# EasyEDA Pro project 第二版-FD6288Q-V1.0.epro, board PCB1
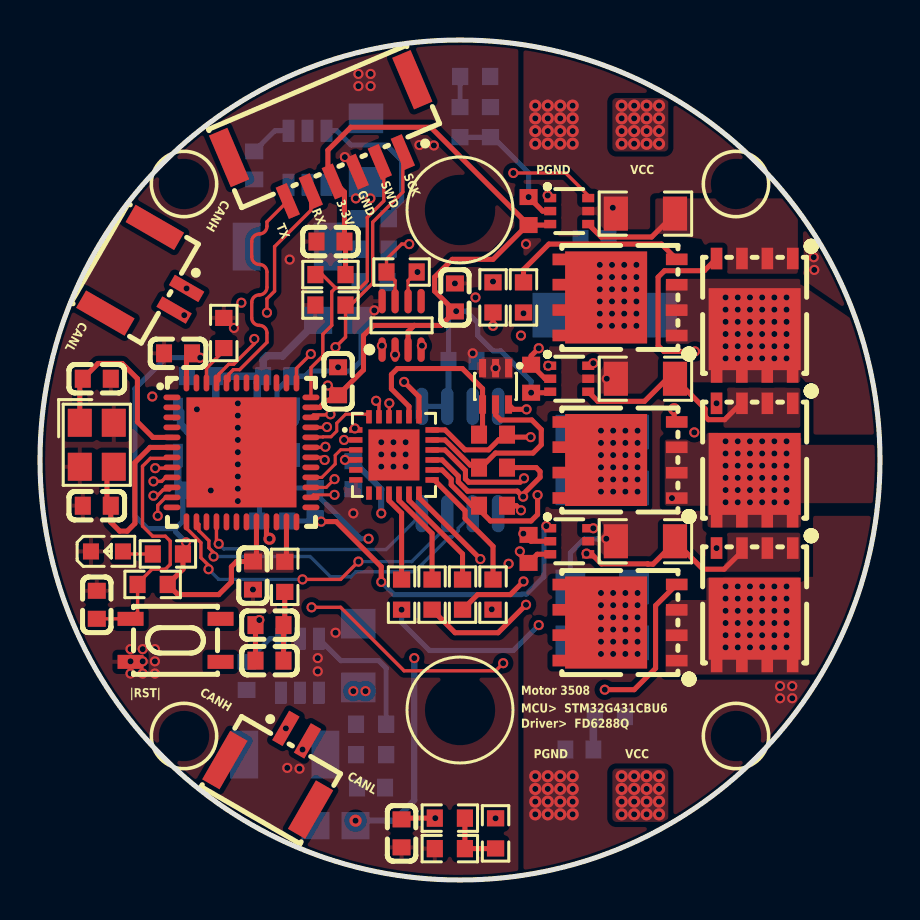
[diagram p1: board, top side]
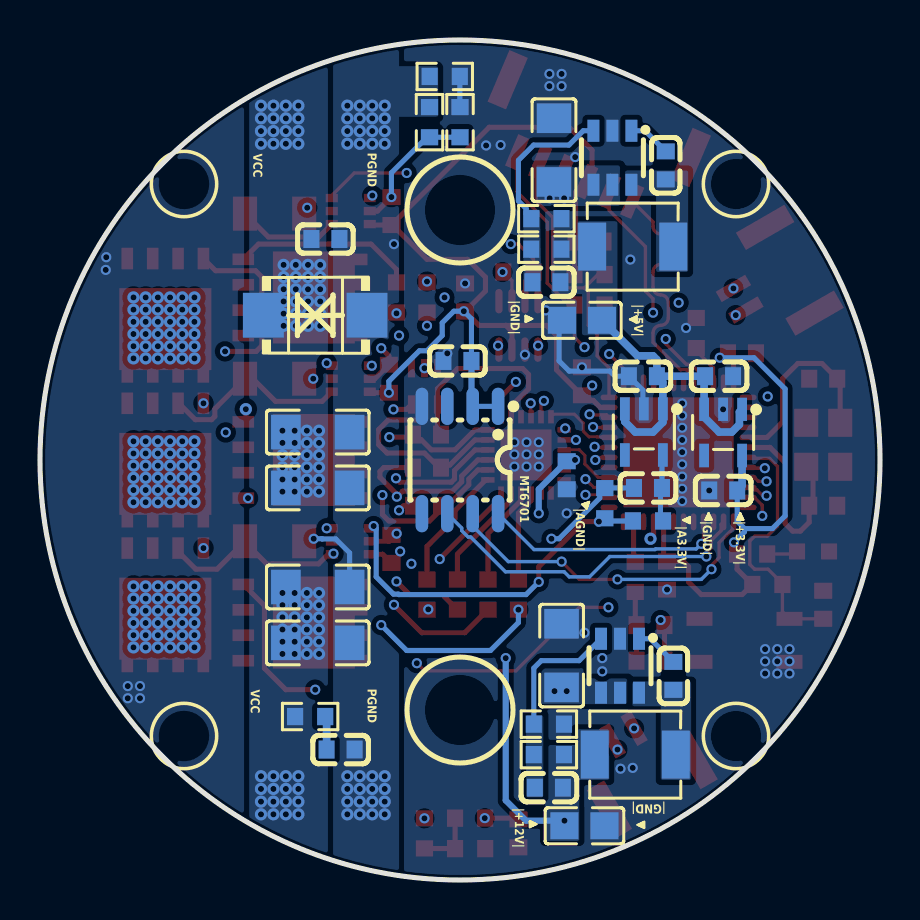
[diagram p2: board, bottom side, seen from below]

Outline 42 x 42 mm; copper layers: Top Layer, Inner1, Inner2, Bottom Layer. Coordinates in mm from the lower left corner of the outline.
Outline path: circle c21,21 r21
Stack: Top Layer 0.035mm 外层铜厚1oz / Dielectric1 0.2104mm 7628 RC49% 8.6mil / Inner1 0.0152mm 内层铜厚 / Dielectric2 1.065mm 1.1mm H/HOZ Copper / Inner2 0.0152mm 内层铜厚 / Dielectric3 0.2104mm 7628 RC49% 8.6mil / Bottom Layer 0.035mm 外层铜厚1oz

## Design rules (mm)
spacing copperThickness1oz (default): track to track 0.102, other pairs 0.152 to 0.3
spacing copperThickness2oz: track to track 0.203, other pairs 0.152 to 0.3
spacing Plane_innerPlane: track to track 0.102, other pairs 0.152 to 0.3
spacing Copper_copperRegion: track to track 0.102, other pairs 0.152 to 0.3
track width copperThickness1oz (default): min 0.127, default 0.254, max 2.54
track width copperThickness2oz: min 0.203, default 0.254, max 2.54
differential pair differentialPair (default): width min 0.127, default 0.254, max 2.54; gap min 0.152, default 0.152
pour e1188 uses Copper_copperRegion
pour e1190 uses Copper_copperRegion
pour e1192 uses Copper_copperRegion
pour e1194 uses Copper_copperRegion
pour e1196 uses Copper_copperRegion
pour e1198 uses Copper_copperRegion
pour e1200 uses Copper_copperRegion
pour e1202 uses Copper_copperRegion
pour e1204 uses Copper_copperRegion
pour e1206 uses Copper_copperRegion
pour e1208 uses Copper_copperRegion
pour e1210 uses Copper_copperRegion
pour e1212 uses Copper_copperRegion
pour e1214 uses Copper_copperRegion
pour e1216 uses Copper_copperRegion
pour e1218 uses Copper_copperRegion
pour e1220 uses Copper_copperRegion
pour e1222 uses Copper_copperRegion
pour e1224 uses Copper_copperRegion
pour e1226 uses Copper_copperRegion
pour e1228 uses Copper_copperRegion
pour e1230 uses Copper_copperRegion
pour e1232 uses Copper_copperRegion
pour e1234 uses Copper_copperRegion
pour e1236 uses Copper_copperRegion
pour e1239 uses Copper_copperRegion
pour e1242 uses Copper_copperRegion
pour e1244 uses Copper_copperRegion
pour e1246 uses Copper_copperRegion
pour e1248 uses Copper_copperRegion
pour e1255 uses Copper_copperRegion
pour e1259 uses Copper_copperRegion
pour e1260 uses Copper_copperRegion
pour e1314 uses Copper_copperRegion
pour e1319 uses Copper_copperRegion
pour e1324 uses Copper_copperRegion
pour e1328 uses Copper_copperRegion
pour e1363 uses Copper_copperRegion
pour e1365 uses Copper_copperRegion
pour e1369 uses Copper_copperRegion
pour e1371 uses Copper_copperRegion

## Placement (name value [footprint] x y rotation side)
C12  47uF  [C1206]  16.3 36.49 270 bottom
C13  100pF  [C0603]  16.68 29.89 180 bottom
C14  22uF  [C0805]  14.9 27.98 180 bottom
C15  10uF  [C0603]  15.67 20.24 90 bottom
C29  10uF  [C0603]  20.75 29.13 270 top
C35  100nF  [C0603]  14.9 24.94 270 top
C36  100nF  [C0603]  10.65 15.22 90 top
C37  100nF  [C0603]  6.9 26.33 0 top
C41  1uF  [C0603]  11.47 12.75 0 top
C42  10nF  [C0603]  11.47 10.97 0 top
C45  100nF  [C0603]  2.84 13.76 90 top
C53  100nF  [C0603]  27.73 32.05 180 bottom
C54  10nF  [C0603]  26.97 6.52 180 bottom
C55  100uF/50V  [C1206]  28.11 14.65 0 bottom
C61  100uF/50V  [C1206]  28.11 11.86 0 bottom
C65  100nF  [C0603]  7.84 19.48 0 bottom
C68  100nF  [C0603]  21.13 25.95 0 bottom
C71  20pF  [C0603]  2.84 25.06 180 top
C72  20pF  [C0603]  2.84 18.71 0 top
C73  1uF  [C0603]  22.65 22.27 180 top
C79  100nF  [C0603]  24.43 33.45 270 top
C80  100nF  [C0603]  24.43 16.56 270 top
C81  100nF  [C0603]  24.56 25.06 270 top
C98  100nF/50V  [C0603]  18.08 2.33 270 top
C100  100nF  [C0603]  10.71 35.73 270 bottom
C101  100nF  [C0603]  10.33 10.2 270 bottom
C102  47uF  [C1206]  15.92 11.22 270 bottom
C103  100pF  [C0603]  16.56 4.62 180 bottom
C104  22uF  [C0805]  14.78 2.71 0 bottom
C105  100nF  [C0603]  8.05 25.19 180 bottom
C106  100nF  [C0603]  11.6 19.6 0 bottom
C107  100nF  [C0603]  11.86 25.19 0 bottom
C108  100uF/50V  [C1206]  28.11 19.6 0 bottom
C109  100uF/50V  [C1206]  28.11 22.4 0 bottom
C110  1uF  [C0603]  22.65 20.62 180 top
C111  1uF  [C0603]  22.65 18.71 180 top
C112  100nF  [C0603]  14.52 31.92 0 top
CN1  WAFER-GH1.25-2PWB  [CONN-TH_2P-P1.25_XUNPU_WAFER-GH1.25-2PWB]  5.76 29.76 240 top
CN2  WAFER-GH1.25-2PWB  [CONN-TH_2P-P1.25_XUNPU_WAFER-GH1.25-2PWB]  12.11 6.01 330 top
D2  SMBJ36CA  [SMB_L4.4-W3.6-LS5.3-BI]  28.24 28.24 180 bottom
D3  BAS16TW  [SOT-363_L2.1-W1.3-P0.65-LS2.3-BL]  22.78 24.68 180 top
L4  3.3uH  [IND-SMD_L4.4-W4.2-A]  12.24 6.27 180 bottom
L5  3.3uH  [IND-SMD_L4.4-W4.2-A]  12.36 31.67 180 bottom
LED6  KT-0603R  [LED0603-RD]  3.35 16.43 0 top
Q1  NCEP4090GU  [PDFN-8_L5.8-W5.1-P1.27-LS6.1-BL]  29 29.13 90 top
Q2  NCEP4090GU  [PDFN-8_L5.8-W5.1-P1.27-LS6.1-BL]  35.73 28.24 180 top
Q3  NCEP4090GU  [PDFN-8_L5.8-W5.1-P1.27-LS6.1-BL]  29 21 90 top
Q4  NCEP4090GU  [PDFN-8_L5.8-W5.1-P1.27-LS6.1-BL]  35.73 21 180 top
Q5  NCEP4090GU  [PDFN-8_L5.8-W5.1-P1.27-LS6.1-BL]  29 12.87 90 top
Q6  NCEP4090GU  [PDFN-8_L5.8-W5.1-P1.27-LS6.1-BL]  35.73 13.76 180 top
R6  10kΩ  [R0603]  11.6 17.95 180 bottom
R7  10kΩ  [R0603]  13.76 18.84 270 bottom
R24  120  [R0603]  18.08 30.4 0 top
R28  0  [R0603]  12.24 15.16 90 top
R29  10K  [R0603]  9.19 27.35 90 top
R30  1K  [R0603]  5.63 14.78 180 top
R33  3.3  [R0603]  28.49 8.17 0 bottom
R42  100  [R0603]  24.18 29.13 90 top
R52  100  [R0603]  22.65 29.13 90 top
R53  100  [R0603]  22.65 14.27 270 top
R54  100  [R0603]  21.13 14.27 270 top
R56  100  [R0603]  18.08 14.27 270 top
R60  100  [R0603]  19.6 14.27 270 top
R65  34.8K  [R0603]  22.78 2.33 90 top
R66  56  [R0603]  20.49 3.09 180 top
R67  4.99K  [R0603]  20.49 1.57 0 top
R68  2mΩ  [R1206]  30.27 33.32 0 top
R69  2mΩ  [R1206]  30.27 25.06 0 top
R70  2mΩ  [R1206]  30.27 16.94 0 top
R72  110K  [R0603]  16.68 31.54 0 bottom
R73  15K  [R0603]  16.68 33.06 0 bottom
R74  390K  [R0603]  16.56 6.27 0 bottom
R75  20K  [R0603]  16.56 7.79 0 bottom
R79  1K  [R0603]  6.4 16.3 180 top
R80  0  [R0603]  21 37.89 270 bottom
R81  0  [R0603]  21.76 40.18 0 bottom
R82  0  [R0603]  22.52 37.89 90 bottom
R85  10K  [R0603]  14.52 30.27 0 top
R86  10K  [R0603]  14.52 28.75 0 top
SW1  K2-1808SN-A3SW-01  [SW-SMD_4P-L4.2-W3.3-P2.15-LS5.1]  6.78 11.98 0 top
U1  STM32G431CBU6  [VQFN-48_L7.0-W7.0-P0.50-BL-EP5.5]  10.07 21.38 270 top
U2  INA199A1DCKR  [SC-70-6_L2.2-W1.3-P0.65-LS2.1-BR]  26.46 33.45 180 top
U4  INA199A1DCKR  [SC-70-6_L2.2-W1.3-P0.65-LS2.1-BR]  26.46 16.94 180 top
U5  MAX3051EKA+T  [SOT-23-8_L3.0-W1.7-P0.65-LS2.8-TL]  18.08 27.73 90 top
U10  FD6288Q  [QFN-24_L4.0-W4.0-P0.50-BL-EP2.6]  17.7 21.25 270 top
U11  MT6701CT-STD  [SOP-8_L4.9-W3.9-P1.27-LS6.0-BL]  21 21 0 bottom
U13  SPX3819M5-L-3-3/TR  [SOT-23-5_L3.0-W1.7-P0.95-LS2.8-BL]  7.84 22.38 0 bottom
U20  INA199A1DCKR  [SC-70-6_L2.2-W1.3-P0.65-LS2.1-BR]  26.46 25.06 180 top
U23  ME3121AM6G  [SOT-23-6_L2.9-W1.6-P0.95-LS2.8-BR]  13.38 36.11 90 bottom
U24  ME3121AM6G  [SOT-23-6_L2.9-W1.6-P0.95-LS2.8-BR]  13 10.71 90 bottom
U25  SPX3819M5-L-3-3/TR  [SOT-23-5_L3.0-W1.7-P0.95-LS2.8-BL]  11.81 22.4 0 bottom
U26  WAFER-GH1.25-6PWB  [CONN-SMD_6P-P1.25_XUNPU_WAFER-GH1.25-6PWB]  14.65 36.62 203 top
X3  8MHz  [CRYSTAL-SMD_4P-L3.2-W2.5-BL]  2.84 21.76 270 top

## Footprints (pads in the part's own frame, mm; a bottom-side part is the same pattern mirrored in y, then rotated)
C0603
  rect 0.8x0.9 smd: 1(-0.7,0) 2(0.7,0)
C0805
  rect 1.41x1.35 smd: 1(-1,0) 2(1,0)
C1206
  rect 1.485x1.728 smd: 1(-1.593,0) 2(1.593,0)
CONN-SMD_6P-P1.25_XUNPU_WAFER-GH1.25-6PWB
  rect 0.6x1.7 smd: 1(-3.125,1.575) 2(-1.875,1.575) 3(-0.625,1.575) 4(0.625,1.575) 5(1.875,1.575) 6(3.125,1.575)
  rect 1x2.8 smd: 7(4.975,-1.575) 8(-4.975,-1.575)
CONN-TH_2P-P1.25_XUNPU_WAFER-GH1.25-2PWB
  rect 0.6x1.7 smd: 1(-0.625,1.45) 2(0.625,1.45)
  rect 1x2.8 smd: 3(-2.475,-1.45) 4(2.475,-1.45)
CRYSTAL-SMD_4P-L3.2-W2.5-BL
  rect 1.4x1.2 smd: 1(-1.1,-0.85) 2(1.1,-0.85) 3(1.1,0.85) 4(-1.1,0.85)
IND-SMD_L4.4-W4.2-A
  rect 1.4x2.4 smd: 1(2.028,0) 2(-2.028,0)
LED0603-RD
  rect 0.8x0.8 smd: 1(-0.799,0) 2(0.799,0)
PDFN-8_L5.8-W5.1-P1.27-LS6.1-BL
  rect 0.58x1.079 smd: 1(-1.905,-2.834) 2(-0.635,-2.834) 3(0.635,-2.834) 4(1.905,-2.834)
  rect 0.58x1.08 smd: 5(1.9,2.834) 6(0.64,2.834) 7(-0.63,2.834) 8(-1.9,2.834)
  rect 4.6x4.1 smd: 9(0,0.695)
QFN-24_L4.0-W4.0-P0.50-BL-EP2.6
  rect 0.28x0.665 smd: 1(-1.25,-1.907) 2(-0.75,-1.907) 3(-0.25,-1.907) 4(0.25,-1.907) 5(0.75,-1.907) 6(1.25,-1.907) 13(1.25,1.907) 14(0.75,1.907) 15(0.25,1.907) 16(-0.25,1.907) 17(-0.75,1.907) 18(-1.25,1.907)
  rect 0.665x0.28 smd: 7(1.907,-1.25) 8(1.907,-0.75) 9(1.907,-0.25) 10(1.907,0.25) 11(1.907,0.75) 12(1.907,1.25) 19(-1.907,1.25) 20(-1.907,0.75) 21(-1.907,0.25) 22(-1.907,-0.25) 23(-1.907,-0.75) 24(-1.907,-1.25)
  rect 2.55x2.55 smd: 25(0,0)
R0603
  rect 0.806x0.864 smd: 1(-0.753,0) 2(0.753,0)
R1206
  rect 1.208x1.701 smd: 1(-1.479,0) 2(1.479,0)
SC-70-6_L2.2-W1.3-P0.65-LS2.1-BR
  rect 0.6x0.42 smd: 1(0.95,-0.65) 2(0.95,0) 3(0.95,0.65) 4(-0.95,0.65) 5(-0.95,0) 6(-0.95,-0.65)
SMB_L4.4-W3.6-LS5.3-BI
  rect 2.047x2.241 smd: 1(-2.591,0) 2(2.591,0)
SOP-8_L4.9-W3.9-P1.27-LS6.0-BL
  oval 0.63x1.865 smd: 1(-1.905,-2.683) 2(-0.635,-2.683) 3(0.635,-2.683) 4(1.905,-2.683) 5(1.905,2.683) 6(0.635,2.683) 7(-0.635,2.683) 8(-1.905,2.683)
SOT-23-5_L3.0-W1.7-P0.95-LS2.8-BL
  rect 0.49x1.157 smd: 1(-0.95,-1.153) 2(0,-1.153) 3(0.95,-1.153)
  rect 0.49x1.175 smd: 4(0.95,1.153) 5(-0.95,1.153)
SOT-23-6_L2.9-W1.6-P0.95-LS2.8-BR
  rect 1.1x0.6 smd: 1(1.35,-0.95) 2(1.35,0) 3(1.35,0.95) 4(-1.35,0.95) 5(-1.35,0) 6(-1.35,-0.95)
SOT-23-8_L3.0-W1.7-P0.65-LS2.8-TL
  oval 1.222x0.364 smd: 1(-1.211,0.975) 2(-1.211,0.325) 3(-1.211,-0.325) 4(-1.211,-0.975) 5(1.211,-0.975) 6(1.211,-0.325) 7(1.211,0.325) 8(1.211,0.975)
SOT-363_L2.1-W1.3-P0.65-LS2.3-BL
  rect 0.35x0.916 smd: 1(-0.65,-0.908) 2(0,-0.908) 3(0.65,-0.908) 4(0.65,0.908) 5(0,0.908) 6(-0.65,0.908)
SW-SMD_4P-L4.2-W3.3-P2.15-LS5.1
  rect 1.3x0.7 smd: 1(-2.25,1.075) 2(2.25,1.075) 3(-2.25,-1.075) 4(2.25,-1.075)
VQFN-48_L7.0-W7.0-P0.50-BL-EP5.5
  oval 0.28x0.85 smd: 1(-2.75,-3.474) 2(-2.25,-3.474) 3(-1.75,-3.474) 4(-1.25,-3.474) 5(-0.75,-3.474) 6(-0.25,-3.474) 7(0.25,-3.474) 8(0.75,-3.474) 9(1.25,-3.474) 10(1.75,-3.474) 11(2.25,-3.474) 12(2.75,-3.474) 25(2.75,3.474) 26(2.25,3.474) 27(1.75,3.474) 28(1.25,3.474) 29(0.75,3.474) 30(0.25,3.474) 31(-0.25,3.474) 32(-0.75,3.474) 33(-1.25,3.474) 34(-1.75,3.474) 35(-2.25,3.474) 36(-2.75,3.474)
  oval 0.85x0.28 smd: 13(3.474,-2.75) 14(3.474,-2.25) 15(3.474,-1.75) 16(3.474,-1.25) 17(3.474,-0.75) 18(3.474,-0.25) 19(3.474,0.25) 20(3.474,0.75) 21(3.474,1.25) 22(3.474,1.75) 23(3.474,2.25) 24(3.474,2.75) 37(-3.474,2.75) 38(-3.474,2.25) 39(-3.474,1.75) 40(-3.474,1.25) 41(-3.474,0.75) 42(-3.474,0.25) 43(-3.474,-0.25) 44(-3.474,-0.75) 45(-3.474,-1.25) 46(-3.474,-1.75) 47(-3.474,-2.25) 48(-3.474,-2.75)
  rect 5.5x5.5 smd: 49(0,0)

## Nets
As in the schematic.

Pads without a net: CN1 3 4; CN2 3 4; SW1 2 4; U1 1 2 3 4 12 15 17 18 19 22 24 25 29 38 39 40 41 42 43 47; U5 5; U10 5 7 8 21; U11 3 5; U13 4; U25 4; U26 7 8

## Via types
v1: diameter 0.61, hole 0.305, Top Layer to Bottom Layer, 247 vias
v2: diameter 0.508, hole 0.305, Top Layer to Bottom Layer, 150 vias

## Routing (per net, layer and track width the routed paths; a pad name or vN(x,y) marks a point on that pad's centre or on a via; arc(x,y) is an arc through that point)
+3.3V: length 110.6
  Top Layer w0.254: C79.2 24.36,32.75 22.65,31.03 20.62,31.03 19.73,30.14 19.73,29.44 C29.2 20.05,27.73 18.71,27.73 ; C79.2 25.46,32.75 U2.3 ; C79.2 19.54,37.64 15.54,37.64 14.4,36.49 14.4,35.22 15.22,34.39 15.22,31.92 15.28,31.87 R85.2 ; U4.3 24.86,16.29 C80.2 23.99,16.29 v2(23.99,16.43) ; U1.48 7.32,26.05 7.6,26.33 7.79,26.33 v2(8.01,26.11) ; U20.3 25.46,24.36 v2(24.56,24.36) ; 18.71,27.73 18.4,27.42 18.4,26.65 ; 18.71,27.73 16.68,27.73 16.17,27.22 16.17,25.51 C35.2 ; C35.2 14.71,24.24 14.46,23.98 14.34,23.98 13.99,23.63 U1.35 ; C35.2 14.42,24.72 v2(14.39,24.72) ; U1.23 12.32,16 R28.2 ; v2(7.3,16.88) 7.3,16.45 R79.1 7.15,15.54 R30.1 6.89,14.27 8.94,14.27 9.57,14.9 9.57,15.67 9.83,15.92 C36.2 10.82,16.1 U1.20
  Inner2 w0.254: v2(14.39,24.72) 13.51,23.84 13.51,18.46 12.75,17.7 8.94,17.7 8.12,16.88 v2(7.3,16.88) ; v2(24.56,24.36) 24.36,24.36 23.67,23.67 23.67,19.48 23.41,19.22 23.41,18.33 23.79,17.95 24.45,17.95 24.7,17.7 24.7,16.95 24.18,16.43 v2(23.99,16.43)
  Bottom Layer w0.254: v2(8.01,26.11) 6.3,26.11 4.74,24.56 4.74,18.21 5.38,17.57 6.78,17.57 ; 6.78,17.57 7.14,17.94 C65.1 ; 6.78,17.57 6.78,17.41 v2(7.3,16.88) ; U11.1 U11.2 ; C68.1 20.43,28.06 v2(20.81,28.44) 21.31,28.44 21.89,27.86 21.89,27.22 22.65,26.46 23.03,26.46 24.56,24.94 v2(24.56,24.36)
  Bottom Layer w0.305: U11.2 20.43,23.74 C68.1
  Bottom Layer w0.381: C65.1 6.9,19.72 6.9,21.22
+5V: length 17.4
  Bottom Layer w0.381: C107.1 10.86,24.89 U25.1 10.86,22.89 11.35,22.4 12.24,22.4 12.76,22.92 U25.3 ; C107.1 11.16,26.02 11.35,26.21 12.13,26.21 C14.2 ; C107.1 C105.1 8.79,25.14 U13.3 8.79,23.15 8.05,22.4 7.41,22.4 7.03,22.78 7.03,23.4 U13.1 ; 15.93,29.94 C13.2
+12V: length 32.6
  Top Layer w0.254: v2(15.25,21.01) 15.79,21.01
  Inner1 w0.305: v2(17.06,18.33) 18.71,16.68 v2(18.71,11.09)
  Inner2 w0.254: v2(15.25,21.01) 16.43,22.19 16.43,22.65 17.08,23.3 17.69,23.3 18.74,24.36 18.74,24.96 19.37,25.59 v2(22.78,25.59)
  Bottom Layer w0.254: v2(15.25,21.01) 15.6,21.01 C15.2
  Bottom Layer w0.305: v2(18.71,11.09) 18.71,3.98 17.7,2.97 v1(15.78,2.97) ; v2(17.06,18.33) 17.06,19.54 C15.2
+AVDD_3.3V: length 3.3
  Bottom Layer w0.254: U25.5 10.9,21.21 C106.1 10.98,19.53 10.98,17.95
AGND: length 42.1
  Top Layer w0.254: U4.2 24.55,16.94 v2(24.17,17.32) ; v2(24.94,26.59) 24.56,26.21 C81.1 25.26,25.06 U20.2 ; U2.2 25.13,33.45 v2(24.43,34.15)
  Inner2 w0.254: v2(24.43,34.15) 24.94,33.64 v2(24.94,26.59) 23.06,24.71 23.06,18.19 23.65,17.6 23.94,17.6 24.17,17.37 v2(24.17,17.32) 23.91,17.06 v2(16.43,17.06)
  Bottom Layer w0.254: 22.65,37.14 24.43,35.36 v2(24.43,34.15) ; R7.1 14.01,19.34 14.01,19.09 16.05,17.06 v2(16.43,17.06) ; R82.1 R80.2 ; 13.89,19.59 13.88,19.6 C106.2
GND: length 9.4
  Bottom Layer w0.254: R81.1 21.01,38.65 R80.1 ; C14.1 16.05,27.84 16.05,25.95 15.54,25.44 13.51,25.44 13.25,25.19 C107.2 11.86,24.49 11.86,23.61 U25.2
  vias: v2(4.53,11.54) v2(4.53,10.93) v2(4.53,10.32) v2(5.14,11.54) v2(5.14,10.93) v2(5.14,10.32) v2(5.75,11.54) v2(5.75,10.93) v2(5.75,10.32) v2(7.84,23.53) v2(8.54,19.48) v2(9.7,27.6) v2(9.89,23.83) v2(9.89,23.22) v2(9.89,22.61) v2(9.89,22) v2(9.89,21.39) v2(9.89,20.78) v2(9.89,20.17) v2(9.89,19.56) v2(9.89,18.95) v2(10.65,14.52) v2(12.36,5.61) v2(12.48,31.02) v2(12.97,5.56) v2(13.89,11.09) v2(13.89,10.43) v2(14.78,12.36) v2(14.9,25.64) v2(15.24,36.15) v2(15.67,18.33) v2(15.92,40.3) v2(15.92,39.69) v2(16.53,40.3) v2(16.53,39.69) v2(16.72,28.48) v2(17.06,21.89) v2(17.06,21.28) v2(17.06,20.67) v2(17.67,21.89) v2(17.67,21.28) v2(17.67,20.67) v2(17.75,26.27) v2(18.28,21.89) v2(18.28,21.28) v2(18.28,20.67) v2(18.97,36.75) v2(19.69,36.73) v2(20.75,29.83) v2(21.63,26.33)
PGND: length 3.8
  Bottom Layer w0.254: v2(28.32,17.06) 27.9,17.06 27.89,17.05 27.21,17.05 26.52,16.36 C55.1
  vias: v1(24.76,38.72) v1(24.76,38.08) v1(24.76,37.45) v1(24.76,36.81) v1(24.76,5.19) v1(24.76,4.55) v1(24.76,3.92) v1(24.76,3.28) v1(25.39,38.72) v1(25.39,38.08) v1(25.39,37.45) v1(25.39,36.81) v1(25.39,5.19) v1(25.39,4.55) v1(25.39,3.92) v1(25.39,3.28) v1(26.01,38.72) v1(26.01,38.08) v1(26.01,37.45) v1(26.01,36.81) v1(26.01,5.19) v1(26.01,4.55) v1(26.01,3.92) v1(26.01,3.28) v1(26.63,38.72) v1(26.63,38.08) v1(26.63,37.45) v1(26.63,36.81) v1(26.63,5.19) v1(26.63,4.55) v1(26.63,3.92) v1(26.63,3.28) v2(24.3,31.8) v2(28.34,25.06) v2(28.64,33.61) v2(37,9.7) v2(37,9.09) v2(37.61,9.7) v2(37.61,9.09) v2(38.69,31.14) v2(38.71,30.5)
VCC: length 1.9
  Bottom Layer w0.254: v2(16.52,34.08) 16.52,34.68 C12.2 16.3,34.59 v2(15.79,34.08)
  vias: v1(27.99,30.76) v1(27.99,30.15) v1(27.99,29.54) v1(27.99,28.93) v1(27.99,28.32) v1(27.99,27.71) v1(28.05,22.47) v1(28.05,21.86) v1(28.05,21.25) v1(28.05,20.64) v1(28.05,20.03) v1(28.05,19.42) v1(28.05,14.35) v1(28.05,13.74) v1(28.05,13.13) v1(28.05,12.52) v1(28.05,11.91) v1(28.05,11.3) v1(28.6,30.76) v1(28.6,30.15) v1(28.6,29.54) v1(28.6,28.93) v1(28.6,28.32) v1(28.6,27.71) v1(28.66,22.47) v1(28.66,21.86) v1(28.66,21.25) v1(28.66,20.64) v1(28.66,20.03) v1(28.66,19.42) v1(28.66,14.35) v1(28.66,13.74) v1(28.66,13.13) v1(28.66,12.52) v1(28.66,11.91) v1(28.66,11.3) v1(29.08,38.72) v1(29.08,38.08) v1(29.08,37.45) v1(29.08,36.81) v1(29.08,5.19) v1(29.08,4.55) v1(29.08,3.92) v1(29.08,3.28) v1(29.21,30.76) v1(29.21,30.15) v1(29.21,29.54) v1(29.21,28.93) v1(29.21,28.32) v1(29.21,27.71) v1(29.27,22.47) v1(29.27,21.86) v1(29.27,21.25) v1(29.27,20.64) v1(29.27,20.03) v1(29.27,19.42) v1(29.27,14.35) v1(29.27,13.74) v1(29.27,13.13) v1(29.27,12.52) v1(29.27,11.91) v1(29.27,11.3) v1(29.71,38.72) v1(29.71,38.08) v1(29.71,37.45) v1(29.71,36.81) v1(29.71,5.19) v1(29.71,4.55) v1(29.71,3.92) v1(29.71,3.28) v1(29.82,30.76) v1(29.82,30.15) v1(29.82,29.54) v1(29.82,28.93) v1(29.82,28.32) v1(29.82,27.71) v1(29.88,22.47) v1(29.88,21.86) v1(29.88,21.25) v1(29.88,20.64) v1(29.88,20.03) v1(29.88,19.42) v1(29.88,14.35) v1(29.88,13.74) v1(29.88,13.13) v1(29.88,12.52) v1(29.88,11.91) v1(29.88,11.3) v1(30.33,38.72) v1(30.33,38.08) v1(30.33,37.45) v1(30.33,36.81) v1(30.33,5.19) v1(30.33,4.55) v1(30.33,3.92) v1(30.33,3.28) v1(30.95,38.72) v1(30.95,38.08) v1(30.95,37.45) v1(30.95,36.81) v1(30.95,5.19) v1(30.95,4.55) v1(30.95,3.92) v1(30.95,3.28) v2(15.67,9.44) v2(16.28,9.44) v2(22.78,3.08)
VDDA: length 7.3
  Top Layer w0.254: v1(11.47,17.06) 11.32,17.22 U1.21 ; v2(10.97,13) 10.97,12.94 C41.1 C42.1
  Inner2 w0.254: v1(11.47,17.06) 11.47,13.51 v2(10.97,13)
ADC_IN1: length 35.3
  Top Layer w0.168: U1.8 6.56,20.59 v2(5.76,20.59) ; v2(23.67,35.35) 26.28,35.35 27.54,34.1
  Inner1 w0.168: v2(5.76,20.59) 5.15,20.59 4.49,21.25 4.49,25.83 6.72,28.06 6.72,28.45 7.36,29.09 7.6,29.09 14.17,35.66 15.44,35.66 15.9,36.11 22.91,36.11 v2(23.67,35.35)
ADC_IN2: length 32.8
  Top Layer w0.168: U1.9 6.28,20.13 6.08,19.93 v2(5.67,19.93)
  Top Layer w0.254: v2(27.66,25.84) 27.54,25.71 U20.6
  Inner1 w0.168: v2(10.07,28.86) 5.62,24.41 v2(5.62,24.17) ; v2(27.66,25.84) 26.76,24.94 24.94,24.94 24.43,25.44 24.43,26.84 v2(24.05,27.22)
  Inner2 w0.168: v2(10.07,28.86) 10.33,29.13 v2(21.77,29.13) 22.14,29.13 v2(24.05,27.22) ; 5.51,20.11 5.25,20.36 5.25,23.81 v2(5.62,24.17)
ADC_IN3: length 34.1
  Top Layer w0.168: v2(5.67,19.21) 5.87,19.21 6.16,19.51 6.47,19.51 U1.10 ; v2(23.16,10.84) 22.78,10.46 18.21,10.46 15.03,13.63 v2(13.58,13.63)
  Inner1 w0.168: v2(13.58,13.63) 8.43,13.63 6.65,15.41 6.65,18.14 5.67,19.11 v2(5.67,19.21) ; v2(23.43,15.81) 24.62,15.81 25.14,16.33 26.41,16.33 v2(27.66,17.59)
  Inner2 w0.168: v2(23.43,15.81) 23.43,11.11 v2(23.16,10.84)
ADC_IN4: length 28.1
  Top Layer w0.168: v2(5.89,18.21) 5.89,18.74 6.28,19.13 U1.11
  Top Layer w0.254: v2(19.76,3.09) 18.14,3.09
  Inner1 w0.168: v2(5.89,18.21) 6.14,17.95 6.14,12.36 9.7,8.81 9.7,7.28 14.78,2.2 19,2.2 19.76,2.97 v2(19.76,3.09)
BOOT0: length 1.9
  Top Layer w0.168: U1.46 8.32,25.59 9.06,26.33 9.2,26.33
CANH: length 42.8
  Top Layer w0.168: v2(18.46,31.8) 18.08,31.8 17.33,31.04 R24.1 17.75,29.97 U5.7
  Inner2 w0.168: v2(12.29,7.58) 12.36,7.65 12.36,11.35 11.86,11.86 10.97,11.86 4.49,18.33 4.49,26.74 v2(7.33,29.58) 9.29,31.54 18.21,31.54 v2(18.46,31.8)
CANL: length 42.8
  Top Layer w0.168: U5.6 18.4,29.97 R24.2
  Inner2 w0.168: v2(18.87,30.4) 17.94,30.4 arc(17.77,30.47) 17.7,30.63 arc(17.64,30.79) 17.47,30.86 16.41,30.86 arc(16.25,30.79) 16.18,30.63 arc(16.11,30.47) 15.95,30.4 14.89,30.4 arc(14.72,30.47) 14.66,30.63 arc(14.59,30.79) 14.43,30.86 13.36,30.86 arc(13.2,30.79) 13.13,30.63 arc(13.07,30.47) 12.9,30.4 11.84,30.4 arc(11.68,30.47) 11.61,30.63 arc(11.54,30.79) 11.38,30.86 10.31,30.86 arc(10.15,30.79) 10.08,30.63 arc(10.02,30.47) 9.85,30.4 9.37,30.4 v2(7.21,28.24) 4.87,25.9 4.87,18.33 10.84,12.36 12.36,12.36 13.13,11.6 v2(13.13,6.52)
FDCAN1_RX: length 7.8
  Top Layer w0.168: v2(14.35,22.65) 14.33,22.63 U1.33
  Inner2 w0.168: v2(14.35,22.65) 14.9,22.65 16.3,24.05 16.3,24.43 17.32,25.44 18.33,25.44 19.09,26.21 v2(19.09,26.72)
FDCAN1_TX: length 7.8
  Top Layer w0.168: v2(14.52,23.29) 14.49,23.25 13.67,23.25 U1.34
  Inner2 w0.168: v2(14.52,23.29) 15.03,23.29 15.98,24.24 15.98,24.41 15.54,24.85 15.54,25.19 15.67,25.32 16.3,25.32 16.56,25.57 16.56,25.83 16.44,25.95 16.04,25.95 15.91,26.08 15.91,26.32 16.3,26.71 17.08,26.71 v2(17.09,26.72)
GH_A: length 9.5
  Top Layer w0.254: U10.19 18.95,24.16 v2(18.21,24.9)
  Inner1 w0.254: v2(18.21,24.9) 18.21,25.26 18.9,25.95 20.14,25.95 22.43,28.24 22.87,28.24 22.88,28.24 23.92,28.24 24.05,28.37
  vias: v2(24.18,28.33)
GH_B: length 14.7
  Top Layer w0.254: v2(24.2,20.09) 24,19.89 21.44,19.89 21.27,20.05 21.27,20.48 20.25,21.5 U10.16 ; R52.1 v2(22.65,27.71)
  Inner1 w0.254: v2(24.2,20.09) 24.2,20.98 23.56,21.61 23.56,23.69 23.79,23.92 23.79,26.57 v2(22.65,27.71)
GH_C: length 6.3
  Top Layer w0.254: R53.1 22.65,16.68 21.25,18.08 21.25,18.46 19.71,20 U10.13
GL_A: length 5.4
  Top Layer w0.254: U10.11 18.45,18.98 21.13,16.3 R54.1
GL_B: length 5
  Top Layer w0.254: U10.10 17.95,18.98 19.6,17.32 R60.1
GL_C: length 4.6
  Top Layer w0.254: U10.9 17.45,18.97 18.08,18.34 R56.1
NRST: length 13.2
  Top Layer w0.168: U1.7 6.55,21.08 5.52,21.08 5.12,20.69 5.12,17.7 5.63,17.19 6.27,17.19 6.51,16.95 6.51,15.78 6.27,15.54 5.6,15.54 4.84,14.78 ; C45.1 4.52,13.06 SW1.1 4.88,13.41 R30.2
OSC_IN: length 9.8
  Top Layer w0.254: X3.1 1.99,24.91 C71.2 2.9,25.83 4.11,25.83 4.87,25.06 4.87,22.91 5.65,22.13 U1.5
OSC_OUT: length 9.8
  Top Layer w0.254: U1.6 5.5,21.63 4.74,20.87 4.74,17.83 4.36,17.44 3.98,17.44 3.54,17.89 C72.2 3.35,18.91 3.35,20.32 X3.3
PWMAH: length 8.4
  Top Layer w0.168: U10.22 17.47,23.18 v2(17.47,23.84) ; v2(14.23,21) 14.1,21.13 U1.30
  Inner1 w0.152: 14.07,21.17 13.78,21.46 13.78,23.23 14.99,24.45 17.01,24.45 17.19,24.27 17.19,24.26 17.47,23.98 v2(17.47,23.84)
  Inner1 w0.168: v2(14.23,21) 14.07,21.17
PWMAL: length 5.2
  Top Layer w0.152: v2(14.73,19.26) 13.68,19.26 U1.26
  Inner1 w0.152: v2(15.74,22.58) 16.05,22.27 16.05,20.58 v2(14.73,19.26)
PWMBH: length 5.5
  Top Layer w0.168: v2(16.81,23.96) 16.95,23.82 U10.23 ; v2(14.27,21.66) 14.24,21.63 U1.31
  Inner1 w0.152: v2(14.27,21.66) 14.27,21.89 14.83,22.45 14.83,22.57 15.68,23.41 15.68,23.68 16.05,24.05 16.72,24.05 v2(16.81,23.96)
PWMBL: length 4.1
  Top Layer w0.152: v2(14.73,20.04) 14.31,19.63 U1.27
  Top Layer w0.168: v2(15.2,22) U10.2
  Inner1 w0.168: v2(14.73,20.04) 14.76,20.08 14.76,21.56 v2(15.2,22)
PWMCH: length 3.7
  Top Layer w0.152: U10.24 16.32,23.29 15.28,23.29 14.84,22.85 14.84,22.45 14.55,22.16 14.15,22.16 14.14,22.15 13.57,22.15 U1.32
PWMCL: length 3.1
  Top Layer w0.152: U1.28 14.09,20.13 14.76,20.8 14.76,21.24 15.04,21.51 15.78,21.51 U10.3
REF: length 34.5
  Top Layer w0.254: v2(14.06,17.92) 14.81,17.92 17.06,15.67 v2(17.06,14.9)
  Inner2 w0.254: v2(25.32,17.7) 25.41,17.79 v2(25.41,25.71) 25.41,26.31 25.47,26.37 25.47,26.81 25.38,26.9 v2(25.38,34.22)
  Bottom Layer w0.254: v2(25.32,17.7) 25.19,17.57 25.19,15.16 24.33,14.29 24.08,14.29 24.06,14.27 17.7,14.27 v2(17.06,14.9) ; 13.89,18.09 13.75,17.95 12.48,17.95 ; 13.89,18.09 v2(14.06,17.92) ; 13.89,18.09 R7.2
SH_A: length 17.9
  Top Layer w0.254: U10.18 20.25,22.5 21.25,21.51 22.43,21.51 22.94,22.02 23.1,22.02 C73.1 23.48,22.14 v2(24.53,22.14)
  Inner1 w0.254: v1(34.28,26.08) 32.62,24.42 32.62,23.6 31.85,22.83 30.98,22.83 30.53,23.29 25.67,23.29 v2(24.53,22.14)
  vias: v1(34.28,29.13) v1(34.28,28.52) v1(34.28,27.91) v1(34.28,27.3) v1(34.28,26.69) v1(34.89,29.13) v1(34.89,28.52) v1(34.89,27.91) v1(34.89,27.3) v1(34.89,26.69) v1(34.89,26.08) v1(35.5,29.13) v1(35.5,28.52) v1(35.5,27.91) v1(35.5,27.3) v1(35.5,26.69) v1(35.5,26.08) v1(36.11,29.13) v1(36.11,28.52) v1(36.11,27.91) v1(36.11,27.3) v1(36.11,26.69) v1(36.11,26.08) v1(36.72,29.13) v1(36.72,28.52) v1(36.72,27.91) v1(36.72,27.3) v1(36.72,26.69) v1(36.72,26.08) v1(37.33,29.13) v1(37.33,28.52) v1(37.33,27.91) v1(37.33,27.3) v1(37.33,26.69) v1(37.33,26.08)
SH_B: length 16.8
  Top Layer w0.254: C110.1 24.81,20.62 25,20.43 25,20.13 24.16,19.29 v2(24.16,19.17) 24.14,19.17 23.87,19.44 21.38,19.44 20.92,19.91 20.92,20.19 20.11,21 U10.15
  Inner1 w0.254: v2(31.6,19.09) 30.96,18.46 24.86,18.46 v2(24.16,19.17)
  vias: v1(34.28,21.94) v1(34.28,21.33) v1(34.28,20.72) v1(34.28,20.11) v1(34.28,19.5) v1(34.28,18.89) v1(34.89,21.94) v1(34.89,21.33) v1(34.89,20.72) v1(34.89,20.11) v1(34.89,19.5) v1(34.89,18.89) v1(35.5,21.94) v1(35.5,21.33) v1(35.5,20.72) v1(35.5,20.11) v1(35.5,19.5) v1(35.5,18.89) v1(36.11,21.94) v1(36.11,21.33) v1(36.11,20.72) v1(36.11,20.11) v1(36.11,19.5) v1(36.11,18.89) v1(36.72,21.94) v1(36.72,21.33) v1(36.72,20.72) v1(36.72,20.11) v1(36.72,19.5) v1(36.72,18.89) v1(37.33,21.94) v1(37.33,21.33) v1(37.33,20.72) v1(37.33,20.11) v1(37.33,19.5) v1(37.33,18.89)
SH_C: length 25.1
  Top Layer w0.254: C111.1 23.82,18.71 v2(24.05,18.48) ; v2(22.02,16.05) 18.95,19.11 U10.12
  Inner1 w0.254: v1(34.28,11.63) 34.28,11.42 33.06,10.2 26.72,10.2 22.02,14.91 v2(22.02,16.05) 22.65,16.05 23.29,16.68 23.29,17.72 v2(24.05,18.48)
  vias: v1(34.28,14.68) v1(34.28,14.07) v1(34.28,13.46) v1(34.28,12.85) v1(34.28,12.24) v1(34.89,14.68) v1(34.89,14.07) v1(34.89,13.46) v1(34.89,12.85) v1(34.89,12.24) v1(34.89,11.63) v1(35.5,14.68) v1(35.5,14.07) v1(35.5,13.46) v1(35.5,12.85) v1(35.5,12.24) v1(35.5,11.63) v1(36.11,14.68) v1(36.11,14.07) v1(36.11,13.46) v1(36.11,12.85) v1(36.11,12.24) v1(36.11,11.63) v1(36.72,14.68) v1(36.72,14.07) v1(36.72,13.46) v1(36.72,12.85) v1(36.72,12.24) v1(36.72,11.63) v1(37.33,14.68) v1(37.33,14.07) v1(37.33,13.46) v1(37.33,12.85) v1(37.33,12.24) v1(37.33,11.63)
SL_A: length 5.1
  Top Layer w0.254: R68.2 30.58,32.15 28.06,32.15 U2.4
SL_B: length 9.4
  Top Layer w0.254: Q4.3 35.05,23.83 34.23,23.02 33.42,23.02 33.26,23.18 33.26,23.56 R69.2 ; 31.36,25.06 30.23,23.93 27.89,23.93 U20.4
SL_C: length 9.6
  Top Layer w0.254: Q6.3 35.1,16.43 34.21,15.54 33.15,15.54 R70.2 31.75,16.89 30.65,15.79 30.4,15.79 30.38,15.81 28.07,15.81 27.56,16.32 v2(27.33,16.32)
SPI1_CS: length 12.2
  Top Layer w0.168: U1.16 8.82,16.92 v2(8.94,16.81)
  Bottom Layer w0.168: v2(8.94,16.81) 9.19,16.56 11.22,16.56 11.25,16.52 17.3,16.52 U11.8
SPI1_MISO: length 16.8
  Top Layer w0.168: U1.14 7.95,17.78 7.95,17.47 8.44,16.97 8.44,16.61 8.68,16.37 v2(8.68,16.17)
  Bottom Layer w0.168: U11.6 20.92,17.6 20.92,17.47 20.59,17.15 20.47,17.15 18.73,15.41 15.79,15.41 15.54,15.16 14.52,15.16 13.51,16.17 v2(8.68,16.17)
SPI1_SCK: length 16.7
  Top Layer w0.168: v2(8.43,15.54) 8.43,15.74 8.05,16.12 8.05,16.87 7.32,17.59 U1.13 ; v2(13.13,15.03) 15.03,15.03 v2(15.92,15.92)
  Bottom Layer w0.168: v2(13.13,15.03) 8.94,15.03 v2(8.43,15.54) ; v2(15.92,15.92) 18.59,15.92 20.37,17.7 U11.7
SWCLK: length 14.4
  Top Layer w0.168: U26.1 18.14,34.4 16.63,32.89 16.63,29.84 15.54,28.75 R86.2 15.28,27.15 v2(14.77,26.64) ; v2(13.54,26.3) 12.82,25.58 U1.37
  Inner1 w0.168: v2(13.54,26.3) 14.43,26.3 v2(14.77,26.64)
SWDIO: length 15.4
  Top Layer w0.168: 14.78,29.6 14.11,30.27 R85.1 ; 14.78,29.6 14.59,29.41 14.59,27.73 14.14,27.29 14.14,26.21 13.55,25.61 U1.36 ; 14.78,29.6 16.01,29.6 16.36,29.95 16.36,33.13 17.19,33.95 17.19,35.71 U26.2
U1_RX: length 11.7
  Top Layer w0.168: U1.45 8.95,24.98 8.95,25.3 9.44,25.79 9.69,25.79 10.71,26.81 v2(10.71,27.05) ; v2(11.35,28.37) 11.35,29.06 11.73,29.44 11.73,31.67 13.54,33.48 U26.5
  Inner1 w0.168: v2(11.35,28.37) 11.35,27.69 v2(10.71,27.05)
U1_TX: length 12.3
  Top Layer w0.168: U1.44 9.45,24.98 9.45,25.3 9.67,25.52 9.98,25.52 11.35,26.88 11.35,27.35 arc(11.24,27.62) 10.97,27.73 arc(10.7,27.84) 10.59,28.11 10.59,28.87 arc(10.7,29.14) 10.97,29.25 arc(11.24,29.37) 11.35,29.64 11.35,30.4 arc(11.24,30.67) 10.97,30.78 arc(10.7,30.89) 10.59,31.16 10.59,31.92 arc(10.7,32.19) 10.97,32.3 arc(11.24,32.41) 11.35,32.68 11.35,32.91 U26.6
VB_A: length 10
  Top Layer w0.254: C73.2 22,22.32 22.13,22.32 D3.4 22.13,24.56 21.12,25.57 17.87,25.57 17.57,25.28 17.57,24.56 18.45,23.68 U10.20
VB_B: length 10.3
  Top Layer w0.254: D3.5 22.78,23.25 23.03,23 24.59,23 25.06,22.52 25.06,21.76 24.65,21.35 22.78,21.35 22.05,20.62 C110.2 ; 21.95,20.75 21.51,20.75 20.25,22 U10.17
VB_C: length 14
  Top Layer w0.254: v2(24.33,23.53) 23.67,23.53 D3.6 ; U10.14 20.1,20.5 20.56,20.05 20.56,19.76 21.6,18.71 C111.2 21.95,18.53 22.52,17.95 24.56,17.95 24.88,18.28 v2(24.88,19.25)
  Inner1 w0.254: v2(24.88,19.25) 25.08,19.45 25.08,20.6 23.92,21.76 23.92,22.29 24.31,22.68 24.33,22.68 24.58,22.93 24.58,23.28 v2(24.33,23.53)
$1N1343: length 12.9
  Top Layer w0.254: v1(31.71,23.54) 31.71,23.03 Q3.4
  Inner1 w0.254: v1(31.71,23.54) 28.79,26.46 25.95,26.46 25.44,26.97 25.44,27.82 23.34,29.92 v2(22.65,29.92)
$1N1357: length 22.2
  Top Layer w0.254: R60.2 20.75,12.36 22.91,12.36 v2(24.3,13.76)
  Inner1 w0.254: v2(33.83,23.83) 33.83,22.91 33.32,22.4 33.32,19.48 29.25,15.41 25.19,15.41 24.94,15.16 24.94,14.4 v2(24.3,13.76)
$1N1370: length 19.8
  Inner1 w0.33: v2(33.83,16.6) 33.74,16.68 31.29,16.68 29.62,15.02 26.1,15.02 25.83,14.74 25.83,13.63 v2(24.94,12.75)
  Bottom Layer w0.254: v2(24.94,12.75) 23.67,11.47 19.48,11.47 18.08,12.87 v2(18.08,13.52)
$1N1373: length 14.9
  Top Layer w0.254: Q5.4 30.78,13.72 30.78,10.59 29.71,9.52 v2(28.24,9.52)
  Inner1 w0.254: v2(28.24,9.52) 26.6,9.52 v2(22.59,13.53)
$1N1378: length 3.1
  Top Layer w0.254: R66.1 R67.2 22.77,1.57 R65.1
$1N1392: length 29.9
  Top Layer w0.254: v2(24.18,14.93) 23.51,14.27 21.88,14.27 R54.2 ; Q2.4 33.22,30.46 31.23,30.46 30.91,30.14 30.91,26.72 31.19,26.43 v2(32.75,26.43)
  Inner1 w0.254: v2(32.71,22.38) 32.71,19.37 29.11,15.77 25.01,15.77 v2(24.18,14.93)
  Inner2 w0.254: v2(32.75,26.43) 32.94,26.24 32.94,22.6 v2(32.71,22.38)
$1N3197: length 2.1
  Bottom Layer w0.254: C100.1 11.74,37.46 U23.1
$1N3439: length 7.5
  Bottom Layer w0.254: R73.2 17.69,33.32 17.69,33.56 18.08,33.95 18.08,35.99 17.32,36.75 15.55,36.75 14.84,37.46 U23.3
$1N4103: length 6.8
  Bottom Layer w0.254: R75.2 17.31,10.59 16.94,10.97 15.04,10.97 13.95,12.06
$1N4119: length 2.2
  Bottom Layer w0.254: C101.1 11.49,12.06 12.05,12.06
$1N4748: length 1.5
  Top Layer w0.168: LED6.2 4.27,16.3 R79.2
$1N5944: length 3.5
  Top Layer w0.254: R28.1 12.24,12.81 12.18,12.75 12.18,10.97
$1N6352: length 1.7
  Bottom Layer w0.381: R33.1 27.67,8.1 C54.1
$1N11617: length 9.1
  Top Layer w0.254: Q1.4 31.07,31.8 25.44,31.8 24.18,30.53 R42.2

## Copper pours and planes (outline as drawn; the poured copper is in the pictures)
+3.3V on Top Layer: 10.21,16.43 12.69,16.43 12.69,15.36 10.26,15.36 10.21,15.41
+5V on Bottom Layer: 15.14,32.94 15.14,32.24 16.43,32.24 16.43,29.29 14.9,29.29 14.9,27.24 13.13,27.24 13.13,32.94
+12V on Top Layer: 21.83,26.14 23.67,26.14 23.67,25.06 21.83,25.06 21.83,25.07
+12V on Bottom Layer: 15.03,1.95 16.74,1.95 16.74,6.75 15.17,6.75 15.17,7.54 13.53,7.54 13.53,5 15.03,5
GND on Top Layer: -0.72,42.84 42.72,42.84 42.72,-0.46 -0.72,-0.46
GND on Bottom Layer: -0.72,42.84 42.72,42.84 42.72,-0.46 -0.72,-0.46
GND on Bottom Layer: -0.72,42.84 42.72,42.84 42.72,-0.46 -0.72,-0.46
GND on Inner1: -0.72,42.84 42.72,42.84 42.72,-0.46 -0.72,-0.46
GND on Inner1: -0.72,42.84 42.72,42.84 42.72,-0.46 -0.72,-0.46
GND on Inner2: -0.72,42.84 42.72,42.84 42.72,-0.46 -0.72,-0.46
PGND on Top Layer: 27.1,3.11 27.08,3.03 27.04,2.96 26.97,2.92 26.89,2.9 24.5,2.9 24.43,2.92 24.36,2.96 24.32,3.03 24.3,3.11 24.3,5.37 24.32,5.44 24.36,5.51 24.43,5.55 24.5,5.57 26.89,5.57 26.97,5.55 27.04,5.51 27.08,5.44 27.1,5.37
PGND on Top Layer: 24.18,42.97 42.46,42.97 42.46,-0.34 24.18,-0.34
PGND on Top Layer: 24.3,38.89 24.32,38.97 24.36,39.04 24.43,39.08 24.5,39.1 26.89,39.1 26.97,39.08 27.04,39.04 27.08,38.97 27.1,38.89 27.1,36.63 27.08,36.56 27.04,36.49 26.97,36.45 26.89,36.43 24.5,36.43 24.43,36.45 24.36,36.49 24.32,36.56 24.3,36.63
PGND on Bottom Layer: 24.18,-0.21 42.08,-0.21 42.21,-0.08 42.21,40.05 39.92,42.34 24.68,42.34 24.05,41.7 24.05,-0.08
PGND on Bottom Layer: 22.14,40.69 26.08,40.69 26.08,38.41 25.83,38.16 22.09,38.16 22.09,40.64
PGND on Inner1: 24.05,-0.59 42.21,-0.59 42.21,42.21 23.67,42.21 24.05,41.83
PGND on Inner2: 23.41,42.84 42.34,42.84 42.34,-0.34 24.18,-0.34 23.41,0.43
VCC on Top Layer: 28.62,38.89 28.64,38.97 28.68,39.04 28.75,39.08 28.82,39.1 31.21,39.1 31.29,39.08 31.35,39.04 31.4,38.97 31.41,38.89 31.41,36.63 31.4,36.56 31.35,36.49 31.29,36.45 31.21,36.43 28.82,36.43 28.75,36.45 28.68,36.49 28.64,36.56 28.62,36.63
VCC on Top Layer: 31.41,3.11 31.4,3.03 31.35,2.96 31.29,2.92 31.21,2.9 28.82,2.9 28.75,2.92 28.68,2.96 28.64,3.03 28.62,3.11 28.62,5.37 28.64,5.44 28.68,5.51 28.75,5.55 28.82,5.57 31.21,5.57 31.29,5.55 31.35,5.51 31.4,5.44 31.41,5.37
VCC on Bottom Layer: 12.62,10.08 14.83,10.08 14.83,10.72 17.06,10.72 17.19,10.59 17.19,8.91 17.31,8.79 12.62,8.79 12.62,8.8
VCC on Bottom Layer: 31.54,-0.21 31.54,42.21 27.6,42.21 27.6,-0.21
VCC on Bottom Layer: 13,35.73 17.19,35.73 17.19,33.7 13,33.7
VCC on Inner1: 30.32,31.6 25.51,31.6 25.51,26.7 30.35,26.7 30.35,31.57
VCC on Inner1: 25.51,23.34 30.4,23.34 30.4,18.71 25.51,18.71
VCC on Inner1: 25.58,10.54 30.4,10.54 30.4,15.23 25.61,15.23 25.58,15.2
VCC on Inner1: 17.39,35.57 15.07,35.57 11.22,31.72 11.22,15.92 14.27,12.87 14.27,8.68 15.26,7.69 15.26,6.71 18.21,3.75 20.49,3.75 20.49,-0.55 31.2,-0.55 31.41,-0.34 31.41,5.76 21.25,5.76 18.08,8.94 18.08,13.94 15.09,16.93 15.09,29.65 17.48,32.04 17.48,35.48
VCC on Inner2: 27.73,0.43 31.92,0.43 31.92,40.94 27.73,40.94 27.73,26.7 28.08,26.7 29.13,25.66 29.13,23.77 28.11,22.75 27.73,22.75 27.73,19.2 28.51,19.2 29.43,18.8 29.43,16.54 28.69,15.81 27.74,15.81 27.7,15.77 27.7,0.46
SH_A on Top Layer: 31.29,30.06 38.02,30.06 38.02,24.88 33.45,24.88 33.45,26.94 31.29,26.94
SH_A on Top Layer: 31.26,29.88 37.9,29.88 42.19,26.95 42.19,22.27 38.67,22.27 38.67,24.88 31.29,24.88 31.26,24.91
SH_B on Top Layer: 31.29,22.01 38.04,22.01 38.04,17.62 33.45,17.62 33.45,18.8 31.29,18.8
SH_B on Top Layer: 42.21,21.76 42.21,18.84 38.03,18.84 38.03,17.64 33.38,17.64 33.38,18.71 31.24,18.71 31.24,22.02 33.32,22.02 33.32,22.4 38.07,22.4 38.07,21.76
SH_C on Top Layer: 31.28,10.27 42.21,10.27 42.21,18.21 38.65,18.21 38.65,15.16 33.32,15.16 33.32,14 31.29,14 31.28,14
SH_C on Top Layer: 38.02,10.33 31.29,10.33 31.29,13.89 33.41,13.89 33.41,15.16 38.02,15.16
SL_A on Top Layer: 37.89,30.02 37.89,34.08 30.76,34.08 30.76,32.33 33.06,32.05 34.16,30.04 34.18,30.02
SL_B on Top Layer: 34.17,24.87 34.17,22.42 38.02,22.42 38.02,24.81 37.89,24.94 34.24,24.94
SL_C on Top Layer: 34.21,17.57 38.02,17.57 38.02,15.16 34.21,15.16
$1N3251 on Bottom Layer: 12.75,34.21 12.75,35.48 9.59,35.48 9.59,30.4 11.2,30.4 11.2,34.21
$1N3439 on Bottom Layer: 16.94,29.38 17.82,29.38 17.82,33.52 17,33.52 16.94,30.27
$1N4098 on Bottom Layer: 9.44,9.92 12.38,9.92 12.38,8.68 10.97,8.68 10.97,5 9.44,5 9.44,9.92
$1N4103 on Bottom Layer: 16.84,4.13 17.7,4.13 17.7,8.24 16.84,8.24

Small or netless copper shapes (teardrops, artwork), in the pictures only: 1 on Inner2

## Text on the board
Bottom Silkscreen Layer: ▲ | |+3.3V| | |GND| | |A3.3V| | |+5V| | |AGND| | MT6701 | |+12V| | PGND | VCC
Top Silkscreen Layer: |RST| | Motor 3508 | MCU> | Driver> | PGND | STM32G431CBU6 | FD6288Q | VCC | CANL | CANH | TX | RX | 3.3V | GND | SWD | SCK
